# EAGLE design alexakit (EAGLE 9.2.2)
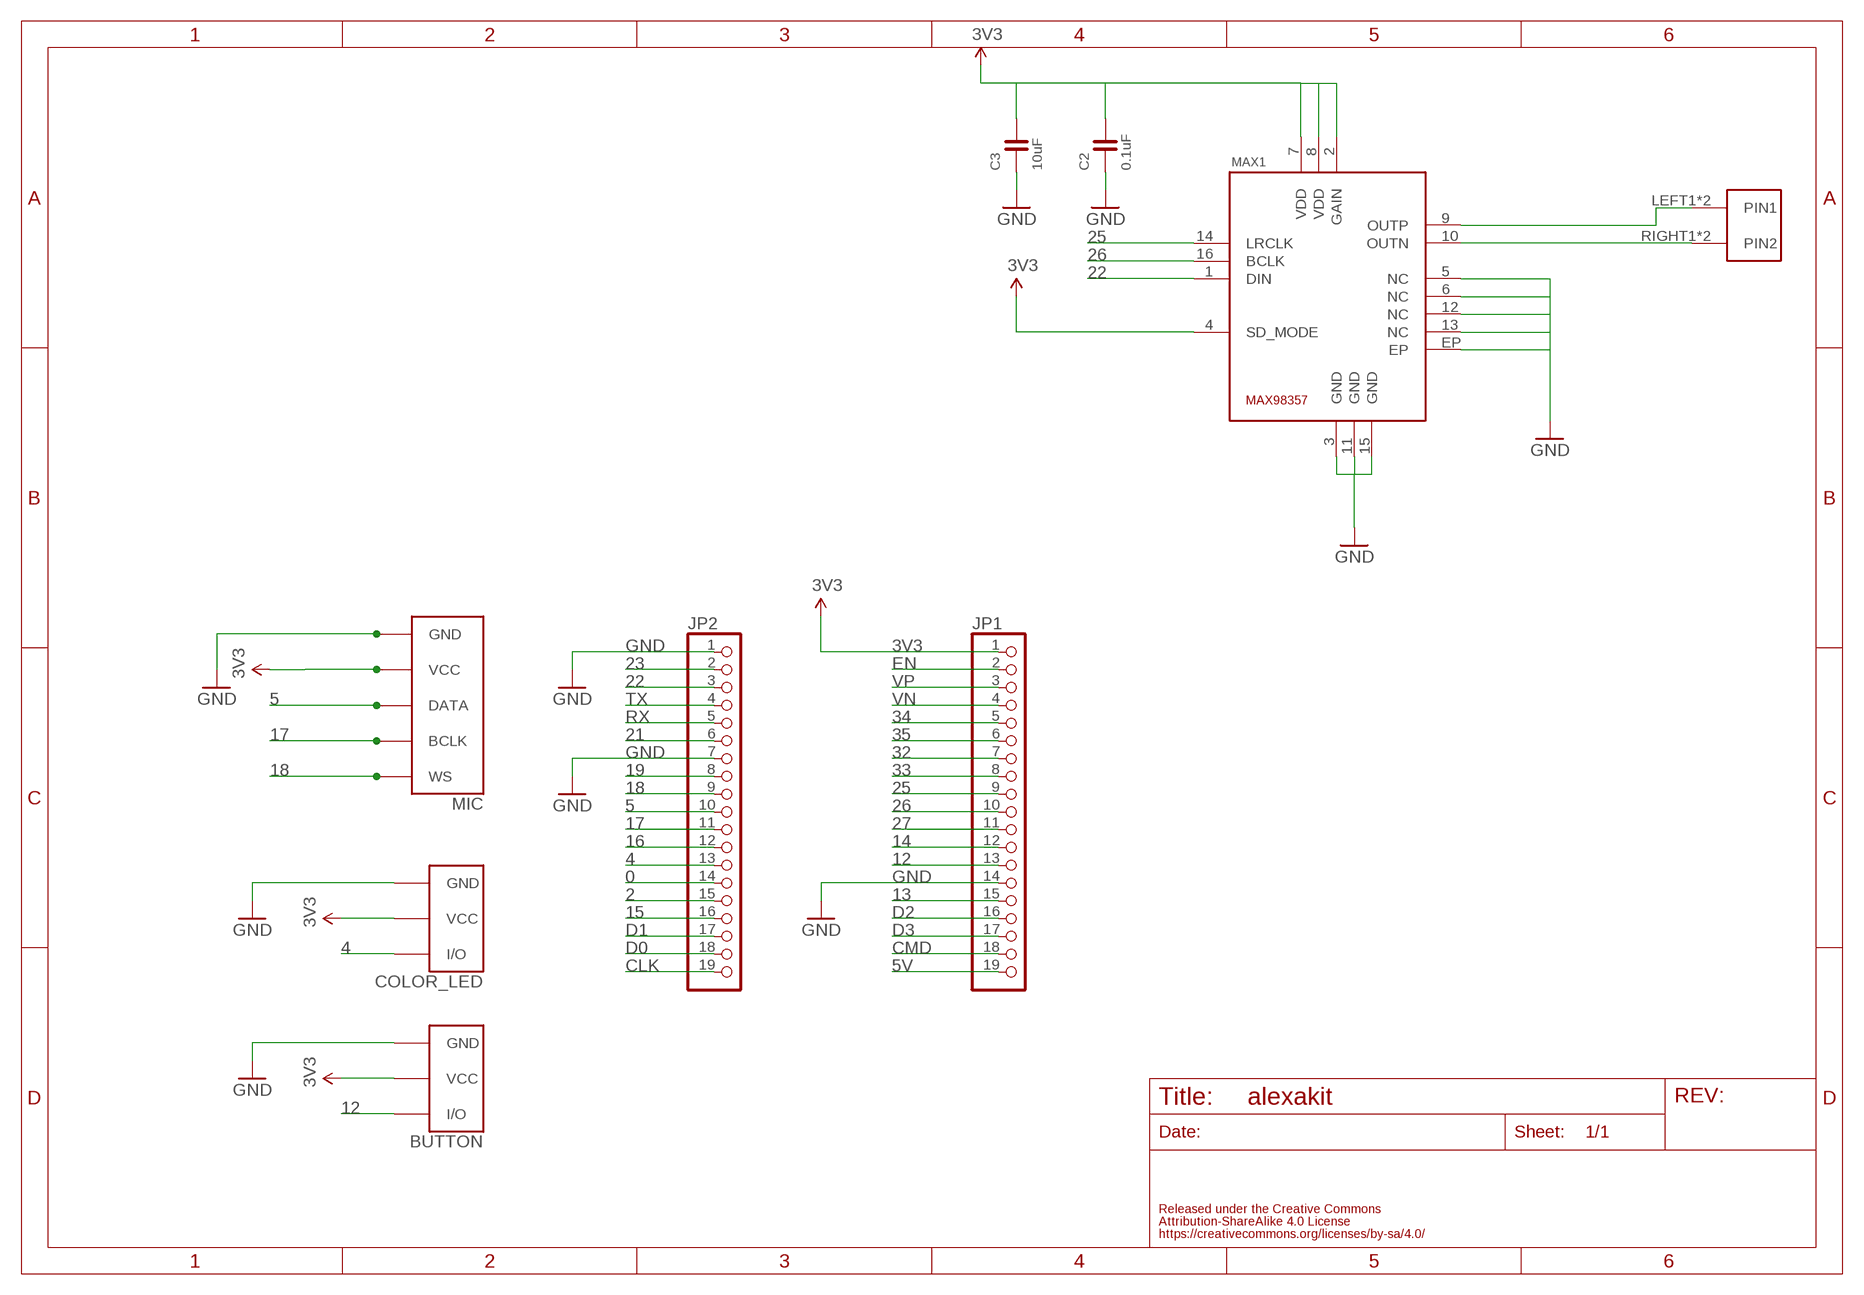
[diagram p0: schematic, sheet 1]

## Parts
BUTTON  BUTTON  FABO_BRICK_3PIN-03B-PASK-1_NAME_BOTTOM  [FABO_BRICK_3PIN_B03B-PASK-1_NAME_BOTTOM]
C2  0.1uF  CAPACITOR-0603  [0603]
C3  10uF  CAPACITOR-0603  [0603]
COLOR_LED  FABO_BRICK_3PIN-03B-PASK-1_NAME_BOTTOM  [FABO_BRICK_3PIN_B03B-PASK-1_NAME_BOTTOM]
JP1  PINHD-1X19  [1X19]
JP2  PINHD-1X19  [1X19]
MAX1  MA-MAX98357  [MAXIM-MAX98357]
MIC  FABO_BRICK_I2STOP  [FABO_BRICK_I2S_B05B-PARK-1]
U$4  ML-1400-S1  [ML-1400-S1]

## Nets
0: JP2.14
2: JP2.15
3V3: BUTTON.VCC C2.2 C3.2 COLOR_LED.VCC JP1.1 MAX1.2(GAIN) MAX1.4(SD_MODE) MAX1.7(VDD) MAX1.8(VDD) MIC.VCC
4: COLOR_LED.I/O JP2.13
5: JP2.10 MIC.DATA
5V: JP1.19
12: BUTTON.I/O JP1.13
13: JP1.15
14: JP1.12
15: JP2.16
16: JP2.12
17: JP2.11 MIC.BCLK
18: JP2.9 MIC.WS
19: JP2.8
21: JP2.6
22: JP2.3 MAX1.1(DIN)
23: JP2.2
25: JP1.9 MAX1.14(LRCLK)
26: JP1.10 MAX1.16(BCLK)
27: JP1.11
32: JP1.7
33: JP1.8
34: JP1.5
35: JP1.6
CLK: JP2.19
CMD: JP1.18
D0: JP2.18
D1: JP2.17
D2: JP1.16
D3: JP1.17
EN: JP1.2
GND: BUTTON.GND C2.1 C3.1 COLOR_LED.GND JP1.14 JP2.1 JP2.7 MAX1.3(GND) MAX1.5(NC) MAX1.6(NC) MAX1.11(GND) MAX1.12(NC) MAX1.13(NC) MAX1.15(GND) MAX1.EP MIC.GND
N$1: MAX1.10(OUTN) U$4.RIGHT1(PIN2) U$4.RIGHT2(PIN2)
N$2: MAX1.9(OUTP) U$4.LEFT1(PIN1) U$4.LEFT2(PIN1)
RX: JP2.5
TX: JP2.4
VN: JP1.4
VP: JP1.3

## Library data of the parts
BUTTON COLOR_LED = FaBo-Template:FABO_BRICK_3PIN: FaBo Brick 3pin
C2 C3 = FaBo-Capacitor:CAPACITOR: CAPACITOR
JP1 JP2 = pinhead:PINHD-1X19: PIN HEADER
MAX1 = FaBo-Mems:MA-MAX98357
MIC = FaBo-Template:FABO_BRICK_I2S
U$4 = FaBo-Terminal:ML-1400-S1

## Board
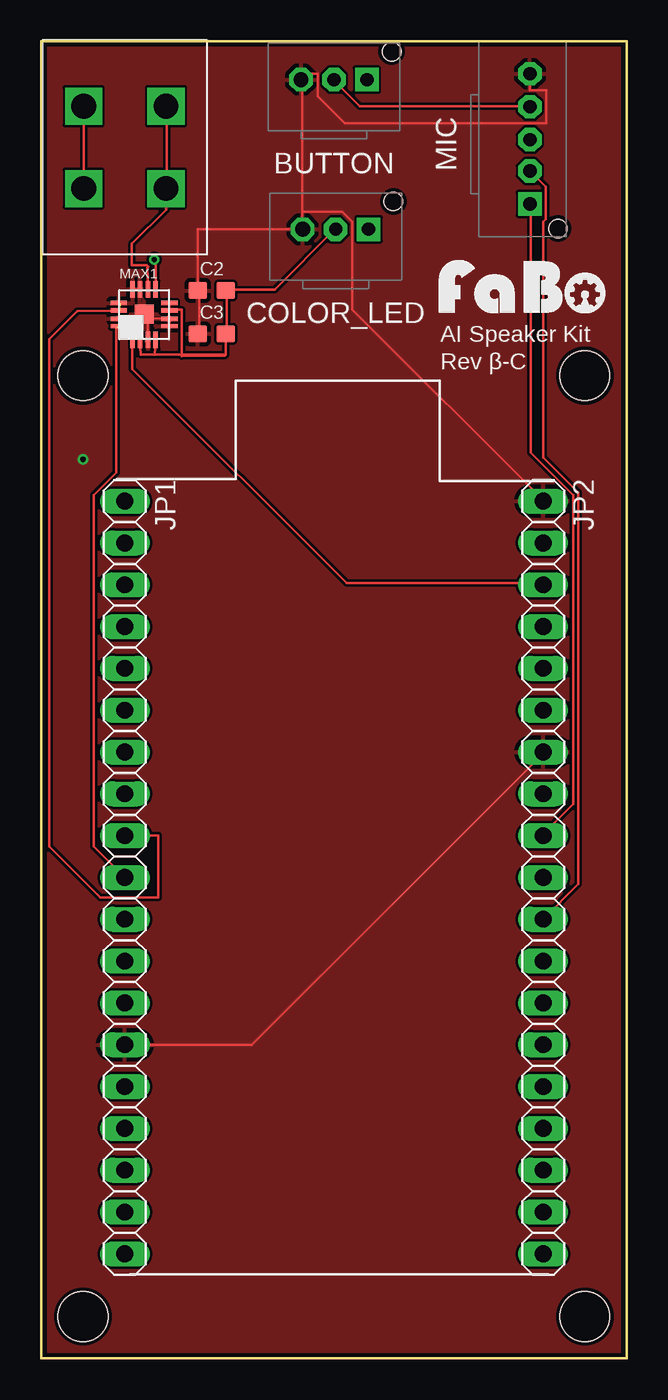
[diagram p1: board, top side]
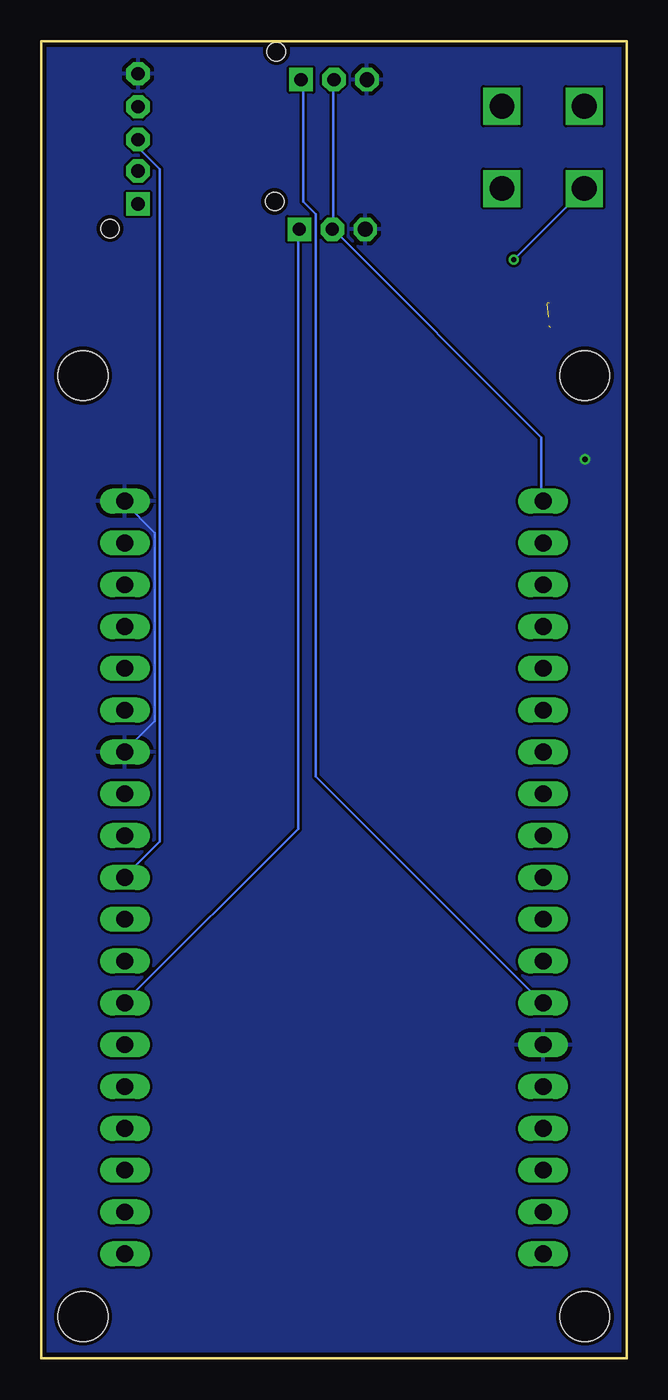
[diagram p2: board, bottom side, seen from below]

Size 35.56 x 80.01 mm. Coordinates in mm from the lower left corner, seen from the top.
Outline: 0,0 35.56,0 35.56,80.01 0,80.01 0,0
Copper layers (1*16): Top 0.035mm / dielectric 1.5mm / Bottom 0.035mm
Design rules "SeeedStudio_2layer_DRU_no_angle_20140221": minimum track width 6mil, minimum drill 12mil, track to track 6mil, track to pad 6mil, pad to pad 6mil, via to via 6mil, smd to smd 0mil, copper to edge 10mil, drill to drill 10mil, minimum pad ring 10mil, minimum via ring 6mil, stop-mask expansion 2mil, vias tented up to drill 100mil, thermal gap 10mil
Holes 3 mm at 2.54,59.69 2.54,2.54 33.02,2.54 33.02,59.69

### Footprints (pad centres in the part's own frame; a part is rotated, then mirrored left to right if it is on the bottom)
FABO_BRICK_3PIN_B03B-PASK-1_NAME_BOTTOM = drill 0.9 pad 1.422 octagon: GND -2,0 | drill 0.8 pad 1.422 square: I/O 2,0 | drill 0.8 pad 1.422 octagon: VCC 0,0 | hole 1.1: 3.5,1.7
0603 = smd 1.1 x 1: 1 -0.85,0; 2 0.85,0
1X19 = drill 1.016 long: 1 -22.86,0; 2 -20.32,0; 3 -17.78,0; 4 -15.24,0; 5 -12.7,0; 6 -10.16,0; 7 -7.62,0; 8 -5.08,0; 9 -2.54,0; 10 0,0; 11 2.54,0; 12 5.08,0; 13 7.62,0; 14 10.16,0; 15 12.7,0; 16 15.24,0; 17 17.78,0; 18 20.32,0; 19 22.86,0
MAXIM-MAX98357 = smd 0.27 x 1: 1 -0.7,-1.54; 2 -0.25,-1.54; 3 0.25,-1.54; 4 0.7,-1.54; 9 0.7,1.54; 10 0.25,1.54; 11 -0.25,1.54; 12 -0.7,1.54 | smd 1 x 0.27: 5 1.54,-0.7; 6 1.54,-0.25; 7 1.54,0.25; 8 1.54,0.7; 13 -1.54,0.7; 14 -1.54,0.25; 15 -1.54,-0.25; 16 -1.54,-0.7 | smd 1.143 x 1.143: EP 0.005,0.02
FABO_BRICK_I2S_B05B-PARK-1 = drill 0.8 pad 1.422 octagon: BCLK 1.635,2.54; DATA -0.27,2.54; GND -4.27,2.54; VCC -2.27,2.54 | drill 0.8 pad 1.422 square: WS 3.635,2.54 | hole 1.1: 5.135,4.24
ML-1400-S1 = drill 1.5 square: LEFT1 -2.5,2.5; LEFT2 -2.5,-2.5; RIGHT1 2.5,2.5; RIGHT2 2.5,-2.5

### Placement (x,y rotation side)
BUTTON  17.78,77.67 0 top
C2  10.36,64.87 0 top
C3  10.36,62.23 0 top
COLOR_LED  17.88,68.58 0 top
JP1  5.08,29.21 270 top
JP2  30.48,29.21 270 top
MAX1  6.25,63.4 0 top
MIC  27.14,73.76 270 top
U$2  [LOGO_FABO_MS]  29.21,63.1 0 top
U$4  5.08,73.56 0 top

### Tracks (layer width: path | path; a pad name or v marks a point on that pad's centre or on a via)
3V3
  Top 0.152: 11.2,60.96 7.05,60.96 | MAX1.8 7.77,64.01 7.77,63.7 MAX1.7 7.92,63.7 8.53,63.7 8.53,60.88 8.53,60.91 8.53,60.92 11.16,60.92 11.2,60.96 | 11.2,60.96 11.21,60.97 C3.2 11.28,62.33 11.28,64.77 C2.2 11.28,64.92 14.17,64.92 17.83,68.58 COLOR_LED.VCC | MIC.VCC 29.57,76.05 19.36,76.05 17.83,77.57 BUTTON.VCC | 7.05,60.96 6.9,60.97 MAX1.4 | MAX1.2 6.05,60.96 7.05,60.96
  Bottom 0.152: 17.83,68.58 17.83,77.57 BUTTON.VCC | 17.83,68.58 5.18,55.93 5.18,52.12 JP1.1 | 17.83,68.58 COLOR_LED.VCC
4
  Bottom 0.152: COLOR_LED.I/O 19.96,68.58 19.96,32.16 30.48,21.64 JP2.13
5
  Bottom 0.152: MIC.DATA 29.57,73.91 29.57,73.46 28.35,72.24 28.35,31.39 30.48,29.26 JP2.10
12
  Bottom 0.152: BUTTON.I/O 19.66,77.57 19.66,70.26 18.9,69.49 18.9,35.36 5.18,21.64 JP1.13
17
  Top 0.152: JP2.11 32.61,28.8 32.61,52.58 30.48,54.71 30.48,69.04 30.63,69.19 30.63,71.17 29.72,72.08 MIC.BCLK
18
  Top 0.152: MIC.WS 29.72,70.1 29.72,55.02 32.31,52.43 32.31,33.68 30.48,31.85 JP2.9
22
  Top 0.152: JP2.3 30.48,47.09 18.54,47.09 5.54,60.09 5.54,61.8 MAX1.1
25
  Top 0.152: MAX1.14 2.2,63.6 0.5,61.9 0.5,31.1 3.6,28 7.1,28 7.1,31.75 JP1.9
26  (1 unrouted)
  Top 0.152: JP1.10 3.2,31.09 3.2,52.43 4.57,53.8 4.57,62.62 4.61,62.6
GND  (via drill 0.35)  (2 unrouted)
  Top 0.152: C3.1 9.6,62.33 9.6,64.77 C2.1 | 7.77,62.79 MAX1.5 MAX1.6 | 5.64,64.92 5.75,64.94 MAX1.11 | 7.77,63.09 MAX1.6 | 5.64,64.92 MAX1.12 | 9.45,64.92 C2.1 | 9.6,64.92 C2.1 | 15.85,68.58 15.85,69.65 | 15.85,68.58 COLOR_LED.GND | JP1.14 12.8,19.05 30.48,36.73 JP2.7 | 15.85,69.65 18.29,69.65 18.9,69.04 18.9,63.7 30.48,52.12 JP2.1 | MAX1.3 6.49,61.9 6.49,63.2 6.35,63.2 | MAX1.15 4.75,63.24 4.75,63.2 5.65,63.2 | MAX1.6 6.35,63.2 | 6.35,63.2 6.35,63.5 6.56,63.5 MAX1.EP | 5.65,63.2 5.64,63.2 | 6.35,63.2 6.05,63.2 5.84,63.2 5.65,63.2 | C2.1 9.51,68.58 15.85,68.58 | 15.85,69.65 15.85,77.67 BUTTON.GND 15.78,78.03 16.79,78.03 16.79,76.68 18.43,75.04 30.67,75.04 30.67,77.02 29.68,77.02 MIC.GND | 4.84,64.06 4.82,64.11
  Bottom 0.152: JP2.1 30.48,51.97 28.65,50.14 28.65,38.71 30.48,36.88 JP2.7
  other vias: 2.54,54.61
  pour Top: 0,0 0,80.01 35.56,80.01 35.56,0
  pour Bottom: 0,0 35.56,0 35.56,80.01 0,80.01
N$1
  Top 0.152: U$4.RIGHT1 7.62,76.05 7.62,71.17 U$4.RIGHT2 7.58,69.78 5.5,67.7 5.5,66.4 6.4,66.4 6.5,66.3 6.45,66.25 MAX1.10
N$2  (via drill 0.3)
  Top 0.152: v6.86,66.75 6.95,66.66 MAX1.9 | U$4.LEFT1 2.59,76.05 2.59,71.17 U$4.LEFT2
  Bottom 0.152: v6.86,66.75 2.59,71.02 U$4.LEFT2

### Text on the board
tPlace: AI Speaker Kit | Rev β-C